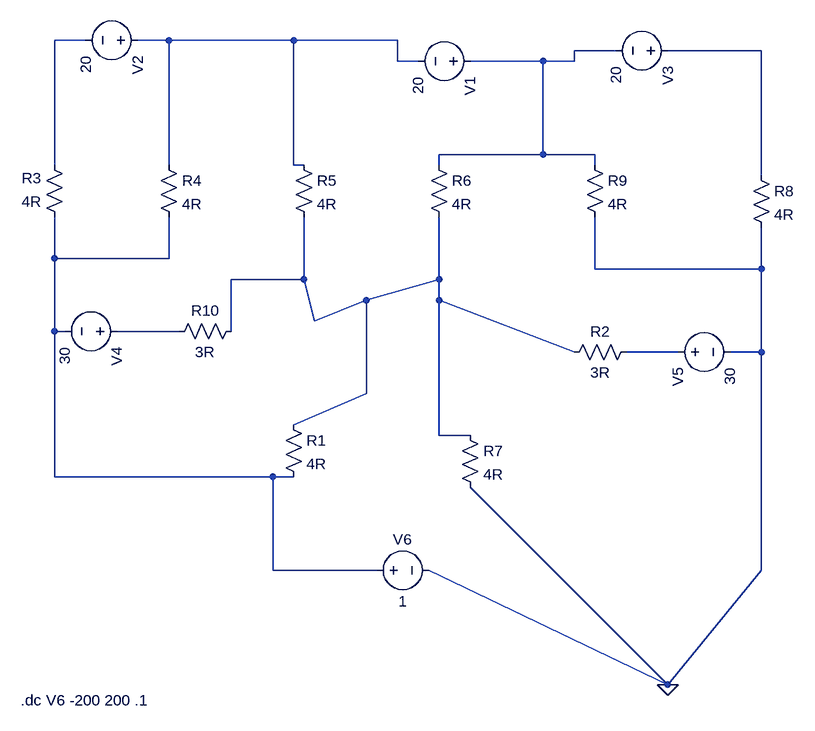
[diagram p0: schematic simulacion.asc]
simulacion.asc, the LTspice schematic file:
Version 4
SHEET 1 1088 680
WIRE -112 -688 -160 -688
WIRE 16 -688 -32 -688
WIRE 208 -688 16 -688
WIRE 368 -688 208 -688
WIRE 704 -672 640 -672
WIRE 928 -672 784 -672
WIRE 368 -656 368 -688
WIRE 400 -656 368 -656
WIRE 592 -656 480 -656
WIRE 640 -656 640 -672
WIRE 640 -656 592 -656
WIRE 592 -512 592 -656
WIRE 592 -512 432 -512
WIRE 672 -512 592 -512
WIRE -160 -496 -160 -688
WIRE 16 -496 16 -688
WIRE 208 -496 208 -688
WIRE 224 -496 208 -496
WIRE 432 -496 432 -512
WIRE 672 -496 672 -512
WIRE 928 -480 928 -672
WIRE -160 -352 -160 -416
WIRE 16 -352 16 -416
WIRE 16 -352 -160 -352
WIRE 672 -336 672 -416
WIRE 928 -336 928 -400
WIRE 928 -336 672 -336
WIRE 224 -320 224 -416
WIRE 224 -320 112 -320
WIRE 432 -320 432 -416
WIRE 320 -288 432 -320
WIRE 432 -288 432 -320
WIRE 240 -256 224 -320
WIRE 240 -256 320 -288
WIRE -160 -240 -160 -352
WIRE -144 -240 -160 -240
WIRE 32 -240 -64 -240
WIRE 112 -240 112 -320
WIRE 640 -208 432 -288
WIRE 800 -208 720 -208
WIRE 928 -208 928 -336
WIRE 928 -208 880 -208
WIRE 320 -144 320 -288
WIRE 208 -96 320 -144
WIRE 432 -80 432 -288
WIRE 480 -80 432 -80
WIRE -160 -16 -160 -240
WIRE 176 -16 -160 -16
WIRE 208 -16 176 -16
WIRE 176 128 176 -16
WIRE 336 128 176 128
WIRE 928 128 928 -208
WIRE 784 304 480 0
WIRE 784 304 416 128
WIRE 784 304 928 128
FLAG 784 304 0
SYMBOL res 192 -112 R0
SYMATTR InstName R1
SYMATTR Value 4R
SYMBOL res 736 -224 R90
WINDOW 0 0 56 VBottom 2
WINDOW 3 32 56 VTop 2
SYMATTR InstName R2
SYMATTR Value 3R
SYMBOL res -144 -400 R180
WINDOW 0 36 76 Left 2
WINDOW 3 36 40 Left 2
SYMATTR InstName R3
SYMATTR Value 4R
SYMBOL res 0 -512 R0
SYMATTR InstName R4
SYMATTR Value 4R
SYMBOL res 208 -512 R0
SYMATTR InstName R5
SYMATTR Value 4R
SYMBOL res 416 -512 R0
SYMATTR InstName R6
SYMATTR Value 4R
SYMBOL res 464 -96 R0
SYMATTR InstName R7
SYMATTR Value 4R
SYMBOL res 912 -496 R0
SYMATTR InstName R8
SYMATTR Value 4R
SYMBOL res 656 -512 R0
SYMATTR InstName R9
SYMATTR Value 4R
SYMBOL res 128 -256 R90
WINDOW 0 0 56 VBottom 2
WINDOW 3 32 56 VTop 2
SYMATTR InstName R10
SYMATTR Value 3R
SYMBOL voltage 496 -656 R90
WINDOW 123 0 0 Left 0
WINDOW 39 0 0 Left 0
SYMATTR InstName V1
SYMATTR Value 20
SYMBOL voltage -16 -688 R90
WINDOW 123 0 0 Left 0
WINDOW 39 0 0 Left 0
SYMATTR InstName V2
SYMATTR Value 20
SYMBOL voltage 800 -672 R90
WINDOW 123 0 0 Left 0
WINDOW 39 0 0 Left 0
SYMATTR InstName V3
SYMATTR Value 20
SYMBOL voltage -48 -240 R90
WINDOW 123 0 0 Left 0
WINDOW 39 0 0 Left 0
SYMATTR InstName V4
SYMATTR Value 30
SYMBOL voltage 784 -208 M90
WINDOW 123 0 0 Left 0
WINDOW 39 0 0 Left 0
SYMATTR InstName V5
SYMATTR Value 30
SYMBOL voltage 320 128 M90
WINDOW 0 -32 56 VBottom 2
WINDOW 3 32 56 VTop 2
WINDOW 123 0 0 Left 0
WINDOW 39 0 0 Left 0
SYMATTR InstName V6
SYMATTR Value 1
TEXT -212 328 Left 2 !.dc V6 -200 200 .1

The netlist it stands for:
* simulacion.asc
R1 N006 N005 4R
R2 N008 N006 3R
R3 N005 N001 4R
R4 N002 N005 4R
R5 N002 N006 4R
R6 N003 N006 4R
R7 N006 0 4R
R8 N004 0 4R
R9 N003 0 4R
R10 N006 N007 3R
V1 N003 N002 20
V2 N002 N001 20
V3 N004 N003 20
V4 N007 N005 30
V5 N008 0 30
V6 N005 0 1
.dc V6 -200 200 .1
.backanno
.end